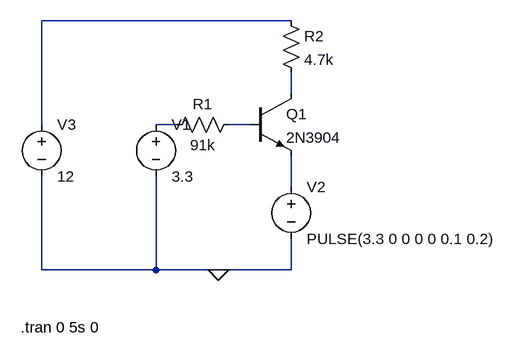
[diagram p0: schematic level_shifter_sim.asc]
level_shifter_sim.asc, the LTspice schematic file:
Version 4
SHEET 1 880 680
WIRE 256 -16 -128 -16
WIRE 256 96 256 64
WIRE -128 144 -128 -16
WIRE 80 144 48 144
WIRE 192 144 160 144
WIRE 256 240 256 192
WIRE -128 368 -128 224
WIRE 48 368 48 224
WIRE 48 368 -128 368
WIRE 144 368 48 368
WIRE 256 368 256 320
WIRE 256 368 144 368
FLAG 144 368 0
SYMBOL npn 192 96 R0
SYMATTR InstName Q1
SYMATTR Value 2N3904
SYMBOL voltage 48 128 R0
SYMATTR InstName V1
SYMATTR Value 3.3
SYMBOL voltage 256 224 R0
SYMATTR InstName V2
SYMATTR Value PULSE(3.3 0 0 0 0 0.1 0.2)
SYMBOL res 176 128 R90
WINDOW 0 0 56 VBottom 2
WINDOW 3 32 56 VTop 2
SYMATTR InstName R1
SYMATTR Value 91k
SYMBOL voltage -128 128 R0
SYMATTR InstName V3
SYMATTR Value 12
SYMBOL res 240 -32 R0
SYMATTR InstName R2
SYMATTR Value 4.7k
TEXT -160 456 Left 2 !.tran 0 5s 0

The netlist it stands for:
* level_shifter_sim.asc
Q1 N002 N004 N005 0 2N3904
V1 N003 0 3.3
V2 N005 0 PULSE(3.3 0 0 0 0 0.1 0.2)
R1 N004 N003 91k
V3 N001 0 12
R2 N001 N002 4.7k
.model NPN NPN
.model PNP PNP
.lib standard.bjt
.tran 0 5s 0
.backanno
.end